# Altium schematic sheet power.SchDoc
size A4; PageSetup: Record=PageOptions|CenterHorizontal=True|CenterVertical=True|PrintScale=0.97|XCorrection=1.00|YCorrection=1.00|PrintKind=0|BorderSize=5000000|LeftOffset=0|BottomOffset=0|Orientation=2|PaperLength=1000|PaperWidth=1000|Scale=100|PaperSource=7|PrintQuality=-4|MediaType=1|DitherType=10|PaperKind=A4|PrintScaleMode=1
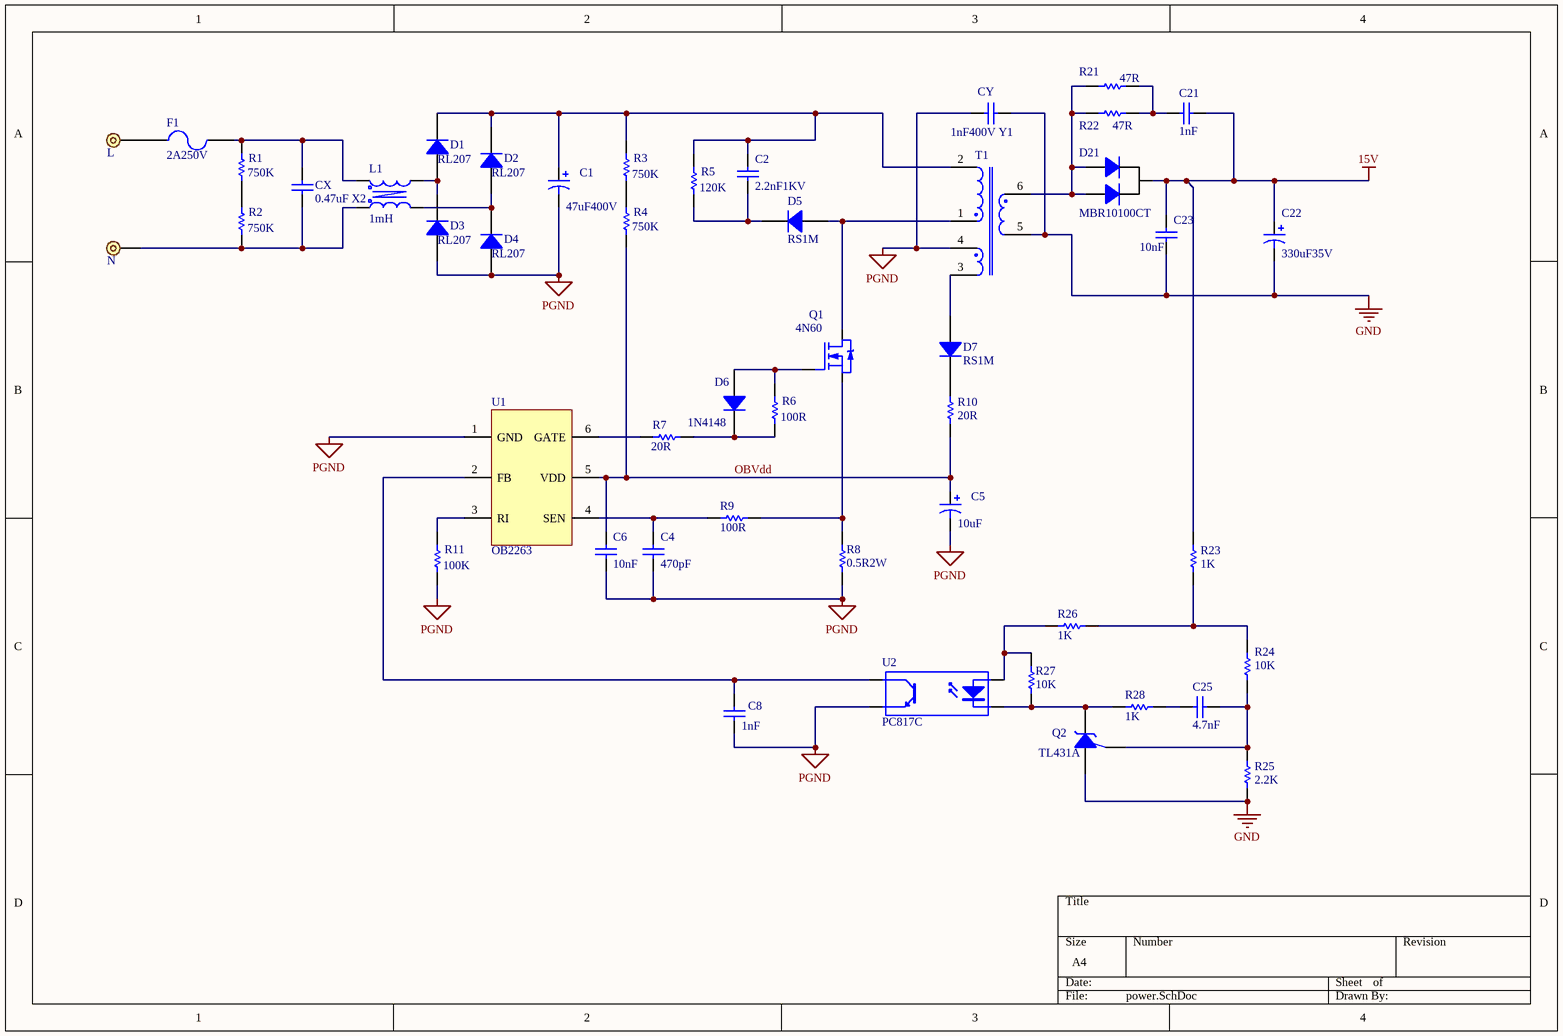
[diagram p0: power.SchDoc]

## Parts
C1  47uF400V  [CAP16x25]
C2  value 2.2nF1KV  [CAP5]  (hidden comment: Cap)
C4  value 470pF  [CAP0805]  (hidden comment: Cap)
C5  10uF  [CAP3]
C6  value 10nF  [CAP0805]  (hidden comment: Cap)
C8  value 1nF  [CAP0805]  (hidden comment: Cap)
C21  value 1nF  [CAP1206]  (hidden comment: Cap)
C22  330uF35V  [CAP10X16]
C23  value 10nF  [CAP0805]  (hidden comment: Cap)
C25  value 4.7nF  [CAP0805]  (hidden comment: Cap)
CX  value 0.47uF X2  [CAPX2]  (hidden comment: Cap)
CY  value 1nF400V Y1  [CAPY2]  (hidden comment: Cap)
D1  RL207  [DIO10mm]
D2  RL207  [DIO10mm]
D3  RL207  [DIO10mm]
D4  RL207  [DIO10mm]
D5  RS1M  [DO214A]
D6  1N4148  [1N4148SMT]
D7  RS1M  [DO214A]
D21  MBR10100CT  [TO220DIO_HS]
F1  2A250V  [FUSE3X10_2]
J1  L  [PAD1]
J2  N  [PAD1]
L1  1mH  [BU10]
Q1  4N60  [TO220MOS_HS]
Q2  TL431A  [SOT23_431]
R1  value 750K  [RES1206]  (hidden comment: Res1)
R2  value 750K  [RES1206]  (hidden comment: Res1)
R3  value 750K  [RES1206]  (hidden comment: Res1)
R4  value 750K  [RES1206]  (hidden comment: Res1)
R5  value 120K  [RES1206]  (hidden comment: Res1)
R6  value 100R  [RES0805]  (hidden comment: Res1)
R7  value 20R  [RES0805]  (hidden comment: Res1)
R8  value 0.5R2W  [RES2W]  (hidden comment: Res1)
R9  value 100R  [RES0805]  (hidden comment: Res1)
R10  value 20R  [RES1206]  (hidden comment: Res1)
R11  value 100K  [RES0805]  (hidden comment: Res1)
R21  value 47R  [RES1206]  (hidden comment: Res1)
R22  value 47R  [RES1206]  (hidden comment: Res1)
R23  value 1K  [RES0805]  (hidden comment: Res1)
R24  value 10K  [RES0805]  (hidden comment: Res1)
R25  value 2.2K  [RES0805]  (hidden comment: Res1)
R26  value 1K  [RES0805]  (hidden comment: Res1)
R27  value 10K  [RES0805]  (hidden comment: Res1)
R28  value 1K  [RES0805]  (hidden comment: Res1)
T1  Transformer  [PQ20C1]  (value not drawn)
U1  OB2263  [SOT23-6]
U2  PC817C  [DIP-4]

## Nets
15V: C21.1 C22.1 C23.2 D21.2(K) R23.1
GND: C22.2 C23.1 CY.1 Q2.2(A) R25.1 T1.5
PGND: C1.2 C4.1 C5.2 C6.1 C8.1 CY.2 D3.1(A) D4.1(A) R8.2 R11.1 T1.4 U1.1(GND) U2.3(E)
OBVdd: C5.1 C6.2 R4.1 R10.2 U1.5(VDD)
NetC1_1: C1.1 C2.2 D1.2(K) D2.2(K) R3.2 R5.2 T1.2
NetC2_1: C2.1 D5.2(K) R5.1
NetC4_2: C4.2 R9.2 U1.4(SEN)
NetC8_2: C8.2 U1.2(FB) U2.4(C)
NetC21_2: C21.2 R21.1 R22.1
NetC25_1: C25.1 Q2.1(R) R24.1 R25.2
NetC25_2: C25.2 R28.1
NetCX_1: CX.1 J2.1 L1.4 R2.1
NetCX_2: CX.2 F1.2 L1.1 R1.2
NetD1_1: D1.1(A) D3.2(K) L1.2
NetD2_1: D2.1(A) D4.2(K) L1.3
NetD5_1: D5.1(A) Q1.D T1.1
NetD6_1: D6.1(A) Q1.G R6.2
NetD6_2: D6.2(K) R6.1 R7.1
NetD7_1: D7.1(A) T1.3
NetD7_2: D7.2(K) R10.1
NetD21_1: D21.1(A) D21.3(A) R21.2 R22.2 T1.6
NetF1_1: F1.1 J1.1
NetQ1_S: Q1.S R8.1 R9.1
NetQ2_3: Q2.3(C) R27.1 R28.2 U2.2(K)
NetR1_1: R1.1 R2.2
NetR3_1: R3.1 R4.2
NetR7_2: R7.2 U1.6(GATE)
NetR11_2: R11.2 U1.3(RI)
NetR23_2: R23.2 R24.2 R26.2
NetR26_1: R26.1 R27.2 U2.1(A)

## Library data of the parts
C1 C5 C22 = Cap Pol2: 电解电容; Published: 8-Jun-2000; LatestRevisionDate: 17-Jul-2002; LatestRevisionNote: Re-released for DXP Platform.; Publisher: Altium Limited
C2 = Cap: 涤纶电容; Published: 8-Jun-2000; LatestRevisionDate: 17-Jul-2002; LatestRevisionNote: Re-released for DXP Platform.; PackageReference: RAD-0.3; Publisher: Altium Limited; PackageDescription: Radial Cap, Thru-Hole; 2 Leads; 0.3 in Pin Spacing
C4 C6 C8 C21 C23 C25 = Cap: 贴片电容; Published: 8-Jun-2000; LatestRevisionDate: 17-Jul-2002; LatestRevisionNote: Re-released for DXP Platform.; PackageReference: RAD-0.3; Publisher: Altium Limited; PackageDescription: Radial Cap, Thru-Hole; 2 Leads; 0.3 in Pin Spacing
CX = Cap: X2 安规电容; Published: 8-Jun-2000; LatestRevisionDate: 17-Jul-2002; LatestRevisionNote: Re-released for DXP Platform.; PackageReference: RAD-0.3; Publisher: Altium Limited; PackageDescription: Radial Cap, Thru-Hole; 2 Leads; 0.3 in Pin Spacing
CY = Cap: Y2 安规电容; Published: 8-Jun-2000; LatestRevisionDate: 17-Jul-2002; LatestRevisionNote: Re-released for DXP Platform.; PackageReference: RAD-0.3; Publisher: Altium Limited; PackageDescription: Radial Cap, Thru-Hole; 2 Leads; 0.3 in Pin Spacing
D1-D4 = Diode: 直插二极管; Published: 8-Jun-2000; LatestRevisionDate: 17-Jul-2002; LatestRevisionNote: Re-released for DXP Platform.; DatasheetDocument: 1999; PackageDocument: Aug-1999; PackageReference: DO-41; Publisher: Altium Limited; ComponentLink1Description: Manufacturer Link; ComponentLink1URL: http://www.fairchildsemi.com/; Code_JEDEC: DO-204-AL
D5-D7 = Diode: 贴片二极管; Published: 8-Jun-2000; LatestRevisionDate: 17-Jul-2002; LatestRevisionNote: Re-released for DXP Platform.; DatasheetDocument: 1999; PackageDocument: Aug-1999; PackageReference: DO-41; Publisher: Altium Limited; ComponentLink1Description: Manufacturer Link; ComponentLink1URL: http://www.fairchildsemi.com/; Code_JEDEC: DO-204-AL
D21 = Diode2: 整流双二极管; Published: 8-Jun-2000; LatestRevisionDate: 17-Jul-2002; LatestRevisionNote: Re-released for DXP Platform.; DatasheetDocument: 1999; PackageDocument: Aug-1999; PackageReference: DO-41; Publisher: Altium Limited; ComponentLink1Description: Manufacturer Link; ComponentLink1URL: http://www.fairchildsemi.com/; Code_JEDEC: DO-204-AL
F1 = Fuse 2: 直插保险丝; Published: 8-Jun-2000; LatestRevisionDate: 17-Jul-2002; LatestRevisionNote: Re-released for DXP Platform.; Publisher: Altium Limited
J1 = Header1: 电源火线; LatestRevisionDate: 17-Jul-2002; LatestRevisionNote: Re-released for DXP Platform.; Publisher: Altium Limited
J2 = Header1: 电源零线; LatestRevisionDate: 17-Jul-2002; LatestRevisionNote: Re-released for DXP Platform.; Publisher: Altium Limited
L1 = TRANS3: 共模电感
Q1 = NMOS: 高压 NMOS; Published: 8-Jun-2000; LatestRevisionDate: 17-Jul-2002; LatestRevisionNote: Re-released for DXP Platform.; PackageVersion: 1995/1996; PackageReference: E3; Publisher: Altium Limited; PackageDescription: TO, Flat Index; 3 In-Line, Axial Leads; Body Dia. 4.6mm; Lead Dia. 0.5 mm (max)
Q2 = TL431: 基准集成电路; Accuracy: 0.5%; Published: 8-Jun-2000; LatestRevisionDate: 17-Jul-2002; LatestRevisionNote: Re-released for DXP Platform.; Publisher: Altium Limited
R1-R7 R9-R11 R21 R22 = Res1: 贴片电阻; Accuracy: 5%; Published: 8-Jun-2000; LatestRevisionDate: 17-Jul-2002; LatestRevisionNote: Re-released for DXP Platform.; PackageReference: AXIAL-0.3; Publisher: Altium Limited; PackageDescription: Axial Device, Thru-Hole; 2 Leads; 0.3 in Pin Spacing
R8 = Res1: 2W 直插电阻; Published: 8-Jun-2000; LatestRevisionDate: 17-Jul-2002; LatestRevisionNote: Re-released for DXP Platform.; PackageReference: AXIAL-0.3; Publisher: Altium Limited; PackageDescription: Axial Device, Thru-Hole; 2 Leads; 0.3 in Pin Spacing
R23-R28 = Res1: 贴片电阻; Accuracy: 1%; Published: 8-Jun-2000; LatestRevisionDate: 17-Jul-2002; LatestRevisionNote: Re-released for DXP Platform.; PackageReference: AXIAL-0.3; Publisher: Altium Limited; PackageDescription: Axial Device, Thru-Hole; 2 Leads; 0.3 in Pin Spacing
T1 = PQ20C1: 变压器; Published: 24-Mar-1999; LatestRevisionDate: 17-Jul-2002; LatestRevisionNote: Re-released for DXP Platform.; Publisher: Altium Limited
U1 = OB2263: 集成电路
U2 = Optoisolator1: 光耦; Published: 24-Mar-1999; LatestRevisionDate: 4-Mar-2005; LatestRevisionNote: Sch pins 3 & 4 Swapped.; DatasheetDocument: Nov-2003; PackageReference: DIP-4; Publisher: Altium Limited